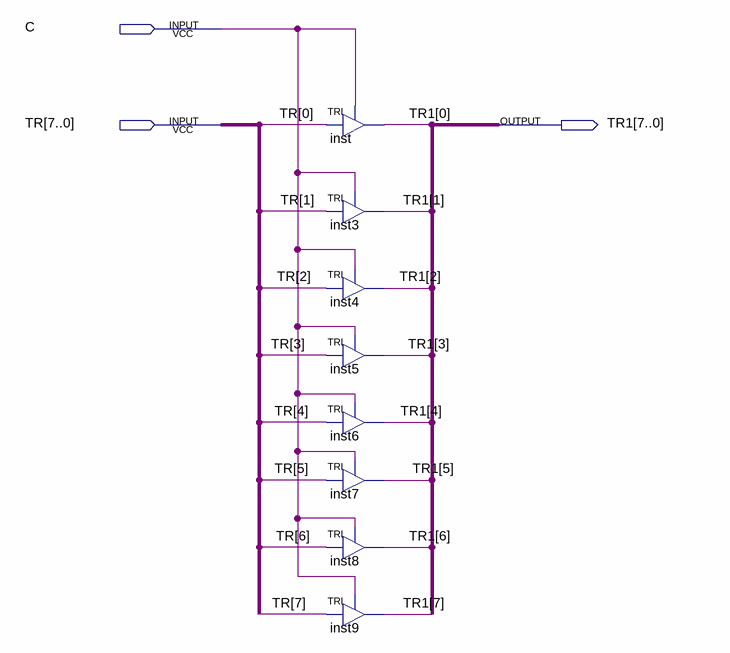
[diagram p0: schematic sheet]
// Quartus schematic TRI1.bdf as structural Verilog: 8 symbols, 3 pins
module TRI1 (
  input  C,
  input  [7:0] TR,
  output [7:0] TR1
);

  TRI inst (.IN(TR[0]), .OE(C), .OUT(TR1[0]));
  TRI inst3 (.IN(TR[1]), .OE(C), .OUT(TR1[1]));
  TRI inst4 (.IN(TR[2]), .OE(C), .OUT(TR1[2]));
  TRI inst5 (.IN(TR[3]), .OE(C), .OUT(TR1[3]));
  TRI inst6 (.IN(TR[4]), .OE(C), .OUT(TR1[4]));
  TRI inst7 (.IN(TR[5]), .OE(C), .OUT(TR1[5]));
  TRI inst8 (.IN(TR[6]), .OE(C), .OUT(TR1[6]));
  TRI inst9 (.IN(TR[7]), .OE(C), .OUT(TR1[7]));
endmodule
